# Altium project Shuttler_AMC.PrjPcb (part 20 of 20)
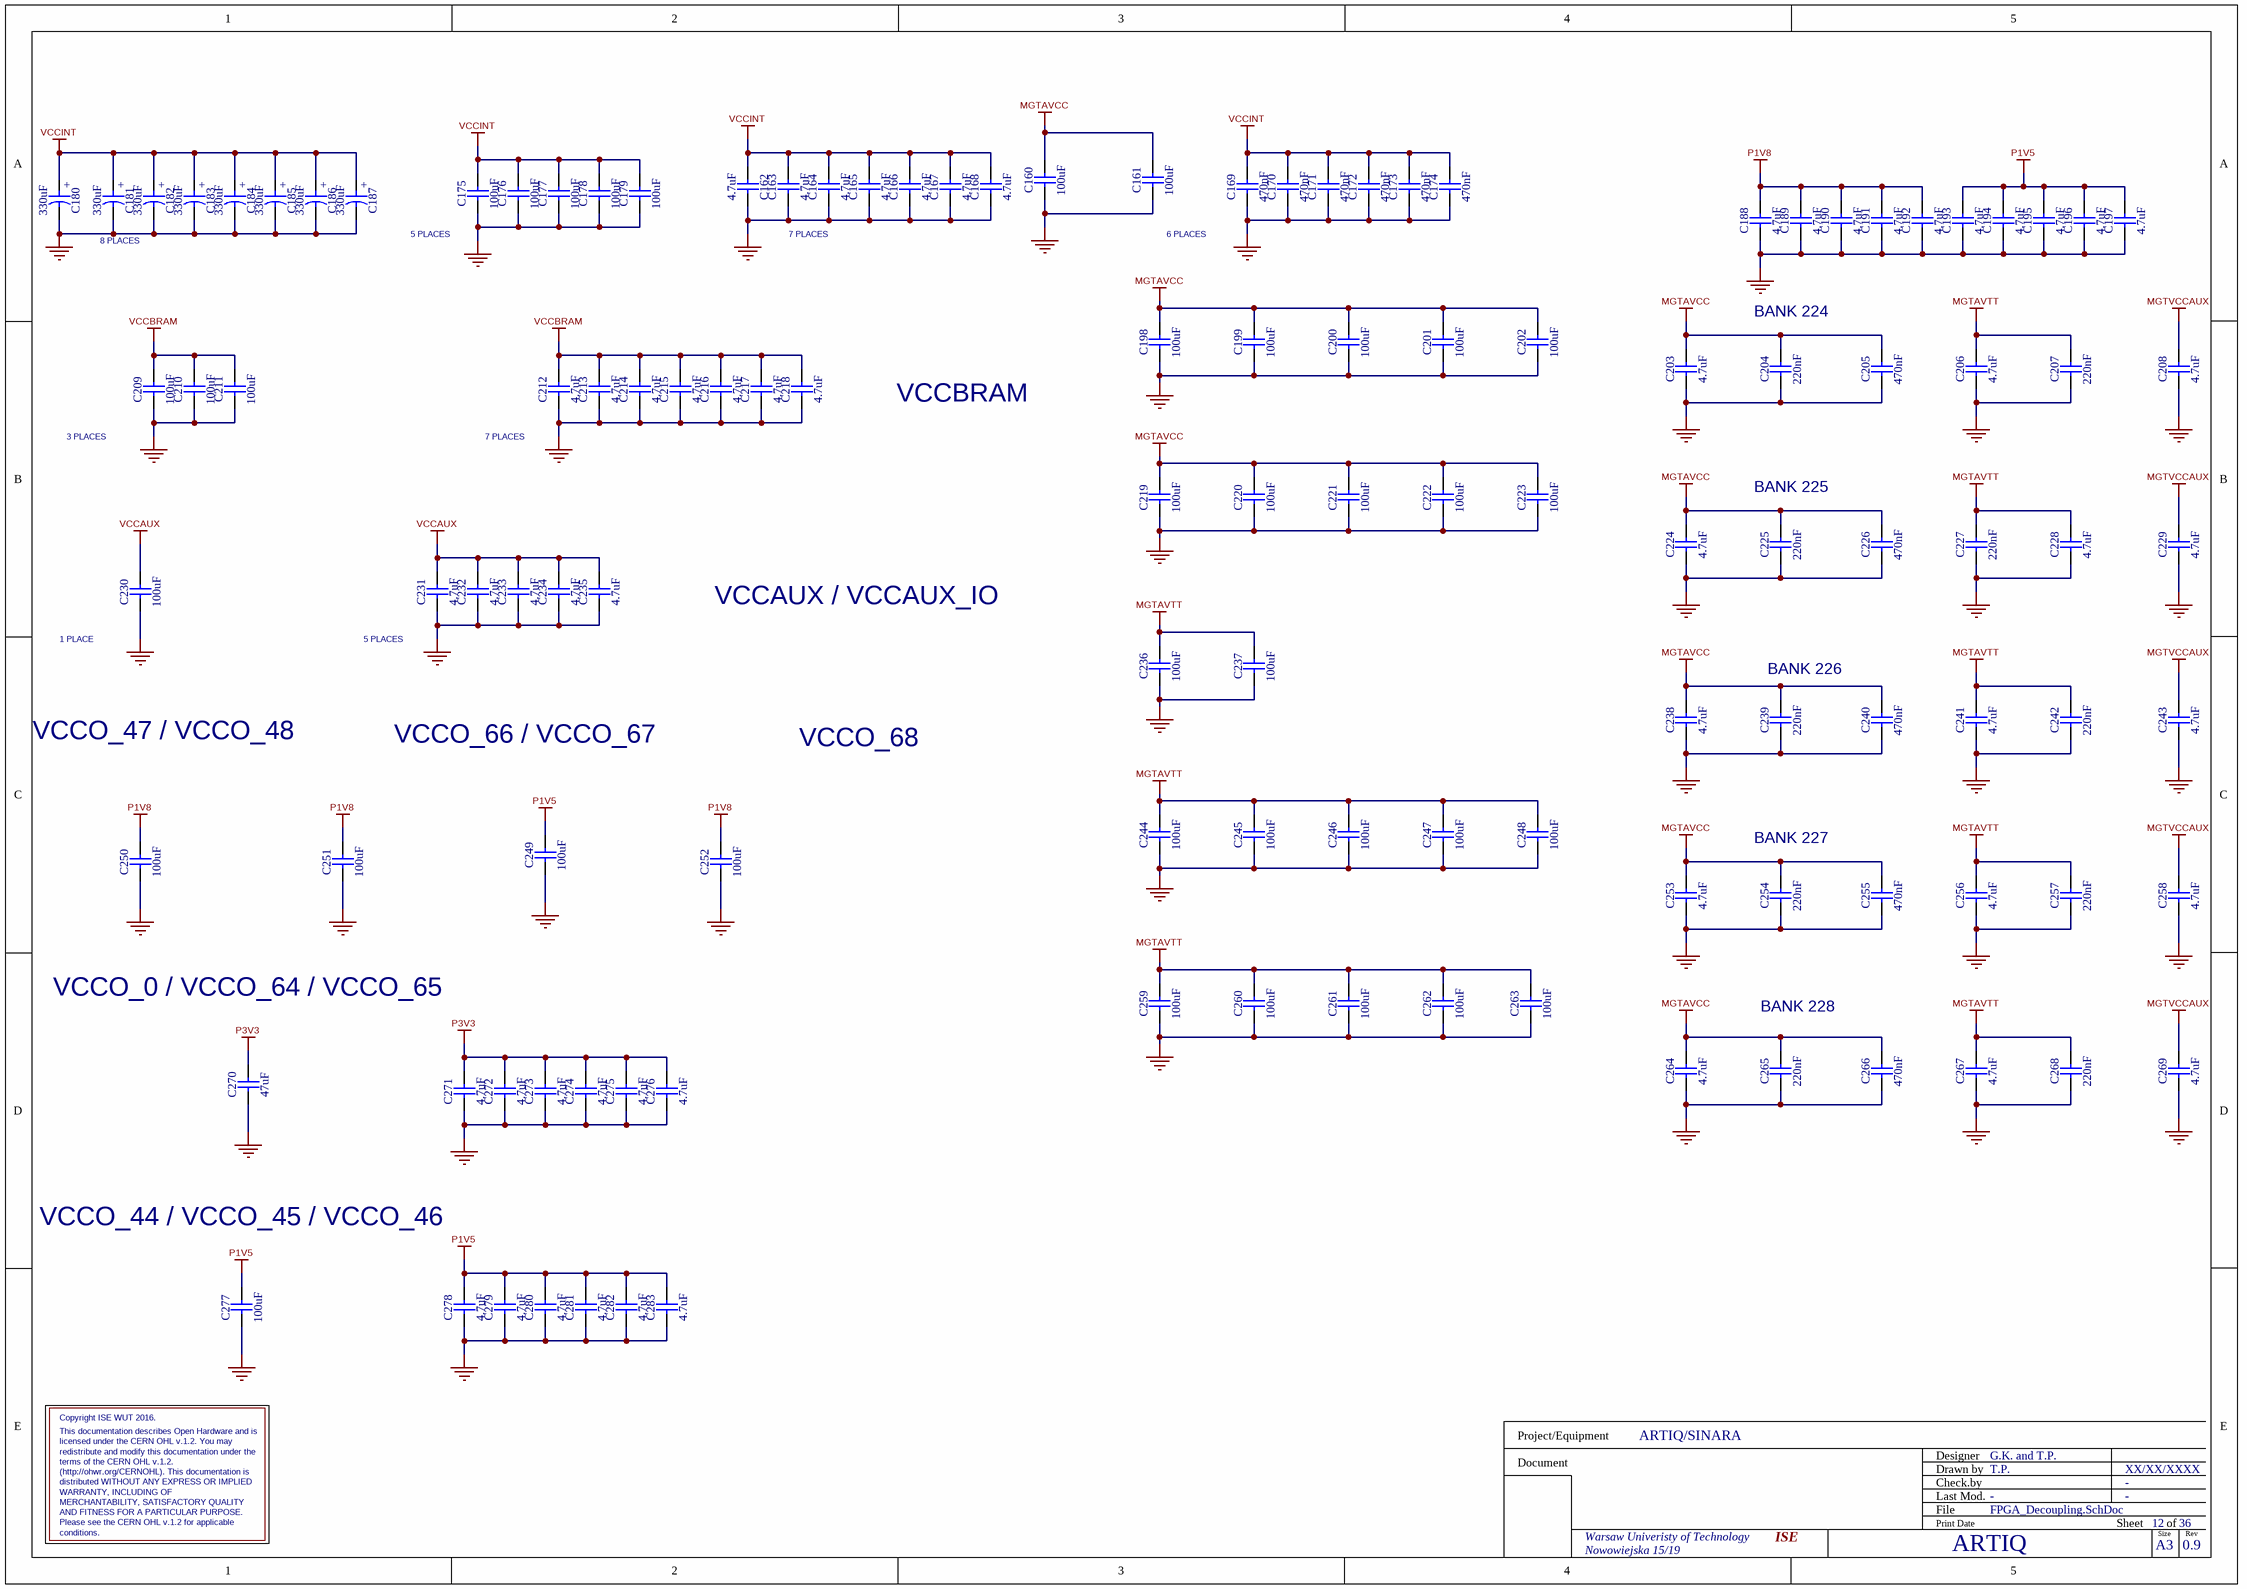
[diagram p38: FPGA_Decoupling.SchDoc]

## Nets that join several sheets (continued)
IOUT_P_U_DAC_LTC2000: DACs/U_DAC_LTC2000 (IC1000_DACs_U_DAC_LTC2000#6.H1), DACs/U_DAC_LTC2000/Amplifier (R1020_DACs_U_DAC_LTC2000_Amplifier#6.1 R1022_DACs_U_DAC_LTC2000_Amplifier#6.2)
IOUT_P_U_DAC_LTC2000: DACs/U_DAC_LTC2000 (IC1000_DACs_U_DAC_LTC2000#7.H1), DACs/U_DAC_LTC2000/Amplifier (R1020_DACs_U_DAC_LTC2000_Amplifier#7.1 R1022_DACs_U_DAC_LTC2000_Amplifier#7.2)
IOUT_P_U_DAC_LTC2000: DACs/U_DAC_LTC2000 (IC1000_DACs_U_DAC_LTC2000#8.H1), DACs/U_DAC_LTC2000/Amplifier (R1020_DACs_U_DAC_LTC2000_Amplifier#8.1 R1022_DACs_U_DAC_LTC2000_Amplifier#8.2)
IOUT_P_U_DAC_LTC2000: DACs/U_DAC_LTC2000 (IC1000_DACs_U_DAC_LTC2000#9.H1), DACs/U_DAC_LTC2000/Amplifier (R1020_DACs_U_DAC_LTC2000_Amplifier#9.1 R1022_DACs_U_DAC_LTC2000_Amplifier#9.2)
IOUT_P_U_DAC_LTC2000: DACs/U_DAC_LTC2000 (IC1000_DACs_U_DAC_LTC2000#10.H1), DACs/U_DAC_LTC2000/Amplifier (R1020_DACs_U_DAC_LTC2000_Amplifier#10.1 R1022_DACs_U_DAC_LTC2000_Amplifier#10.2)
IOUT_P_U_DAC_LTC2000: DACs/U_DAC_LTC2000 (IC1000_DACs_U_DAC_LTC2000#11.H1), DACs/U_DAC_LTC2000/Amplifier (R1020_DACs_U_DAC_LTC2000_Amplifier#11.1 R1022_DACs_U_DAC_LTC2000_Amplifier#11.2)
IOUT_P_U_DAC_LTC2000: DACs/U_DAC_LTC2000 (IC1000_DACs_U_DAC_LTC2000#12.H1), DACs/U_DAC_LTC2000/Amplifier (R1020_DACs_U_DAC_LTC2000_Amplifier#12.1 R1022_DACs_U_DAC_LTC2000_Amplifier#12.2)
IOUT_P_U_DAC_LTC2000: DACs/U_DAC_LTC2000 (IC1000_DACs_U_DAC_LTC2000#13.H1), DACs/U_DAC_LTC2000/Amplifier (R1020_DACs_U_DAC_LTC2000_Amplifier#13.1 R1022_DACs_U_DAC_LTC2000_Amplifier#13.2)
IOUT_P_U_DAC_LTC2000: DACs/U_DAC_LTC2000 (IC1000_DACs_U_DAC_LTC2000#14.H1), DACs/U_DAC_LTC2000/Amplifier (R1020_DACs_U_DAC_LTC2000_Amplifier#14.1 R1022_DACs_U_DAC_LTC2000_Amplifier#14.2)
IOUT_P_U_DAC_LTC2000: DACs/U_DAC_LTC2000 (IC1000_DACs_U_DAC_LTC2000#15.H1), DACs/U_DAC_LTC2000/Amplifier (R1020_DACs_U_DAC_LTC2000_Amplifier#15.1 R1022_DACs_U_DAC_LTC2000_Amplifier#15.2)
IOUT_P_U_DAC_LTC2000: DACs/U_DAC_LTC2000 (IC1000_DACs_U_DAC_LTC2000#16.H1), DACs/U_DAC_LTC2000/Amplifier (R1020_DACs_U_DAC_LTC2000_Amplifier#16.1 R1022_DACs_U_DAC_LTC2000_Amplifier#16.2)
IOUT_P_U_DAC_LTC2000: DACs/U_DAC_LTC2000 (IC1000_DACs_U_DAC_LTC2000#17.H1), DACs/U_DAC_LTC2000/Amplifier (R1020_DACs_U_DAC_LTC2000_Amplifier#17.1 R1022_DACs_U_DAC_LTC2000_Amplifier#17.2)
IOUT_P_U_DAC_LTC2000: DACs/U_DAC_LTC2000 (IC1000_DACs_U_DAC_LTC2000#18.H1), DACs/U_DAC_LTC2000/Amplifier (R1020_DACs_U_DAC_LTC2000_Amplifier#18.1 R1022_DACs_U_DAC_LTC2000_Amplifier#18.2)
IPMB.SCL_L: AMC_Connector (J1.56), CPU_LPC1776 (D2.1 IC11.L3 R43.2)
IPMB.SDA_L: AMC_Connector (J1.71), CPU_LPC1776 (D3.1 IC11.M1 R45.2)
LTM_1V5_OUT: PWR_DC_DC_EXAR2 (C114.2 L70.1 L71.1 MOD1.22), QUAD_BUCK (5 pins)
LTM_1V8_OUT: PWR_DC_DC_EXAR2 (C113.2 L66.1 L68.1 MOD1.18), QUAD_BUCK (5 pins)
LTM_1V_OUT: PWR_DC_DC_EXAR2 (5 pins), QUAD_BUCK (5 pins)
LTM_3V3_OUT: PWR_DC_DC_EXAR2 (C110.2 L49.1 L61.1 MOD1.13), QUAD_BUCK (5 pins)
LTM_PGOOD: QUAD_BUCK (5 pins), CPU_LPC1776 (IC11.A7)
Main_DCXO_N: Clk_recovery (C594.2 C639.2 IC45.2), DDMTD (C730.1)
Main_DCXO_OE: Clk_recovery (R367.1 R383.1), FPGA_Banks_64_65_HR (IC27.P25)
Main_DCXO_P: Clk_recovery (C592.2 IC45.1), DDMTD (C729.1)
Main_DCXO_SCL: Clk_recovery (OSC1.8 R322.1 TP39.1), FPGA_Banks_64_65_HR (IC27.N23)
Main_DCXO_SDA: Clk_recovery (OSC1.7 R325.1 TP38.1), FPGA_Banks_64_65_HR (IC27.N27)
MGT_CDR_CLK_N: DDMTD (C707.1 R483.2), FPGA_Banks_GTH (IC27.AD5)
MGT_CDR_CLK_P: DDMTD (C703.1 R483.1), FPGA_Banks_GTH (IC27.AD6)
MLVDS_AMC_PORTS.Rx17_N: AMC_Connector (J1.141), M-LVDS_PHY (IC34.14)
MLVDS_AMC_PORTS.Rx17_P: AMC_Connector (J1.142), M-LVDS_PHY (IC34.13)
MLVDS_AMC_PORTS.Rx18_N: AMC_Connector (J1.147), M-LVDS_PHY (IC34.4)
MLVDS_AMC_PORTS.Rx18_P: AMC_Connector (J1.148), M-LVDS_PHY (IC34.3)
MLVDS_AMC_PORTS.Rx19_N: AMC_Connector (J1.153), M-LVDS_PHY (IC36.14)
MLVDS_AMC_PORTS.Rx19_P: AMC_Connector (J1.154), M-LVDS_PHY (IC36.13)
MLVDS_AMC_PORTS.Rx20_N: AMC_Connector (J1.159), M-LVDS_PHY (IC36.4)
MLVDS_AMC_PORTS.Rx20_P: AMC_Connector (J1.160), M-LVDS_PHY (IC36.3)
MLVDS_AMC_PORTS.Tx17_N: AMC_Connector (J1.144), M-LVDS_PHY (IC34.10)
MLVDS_AMC_PORTS.Tx17_P: AMC_Connector (J1.145), M-LVDS_PHY (IC34.9)
MLVDS_AMC_PORTS.Tx18_N: AMC_Connector (J1.150), M-LVDS_PHY (IC34.48)
MLVDS_AMC_PORTS.Tx18_P: AMC_Connector (J1.151), M-LVDS_PHY (IC34.47)
MLVDS_AMC_PORTS.Tx19_N: AMC_Connector (J1.156), M-LVDS_PHY (IC36.10)
MLVDS_AMC_PORTS.Tx19_P: AMC_Connector (J1.157), M-LVDS_PHY (IC36.9)
MLVDS_AMC_PORTS.Tx20_N: AMC_Connector (J1.162), M-LVDS_PHY (IC36.48)
MLVDS_AMC_PORTS.Tx20_P: AMC_Connector (J1.163), M-LVDS_PHY (IC36.47)
MLVDS_FSEN: M-LVDS_PHY (8 pins), FPGA_Banks_64_65_HR (IC27.G25)
MMC_CONSOLE.ISP_RSTn: USB_SERIAL_QUAD (T17.3), CPU_LPC1776 (SW1.1)
MMC_CONSOLE.LPC_ISPn: USB_SERIAL_QUAD (IC71.4 R349.1), CPU_LPC1776 (SW1.2)
MMC_CONSOLE.MMC_CONS_PROG_RxD: USB_SERIAL_QUAD (IC71.2), CPU_LPC1776 (IC11.A3)
MMC_CONSOLE.MMC_CONS_PROG_TxD: USB_SERIAL_QUAD (IC71.3), CPU_LPC1776 (IC11.D5)
MMC_I2C.SCL: I2C_MUX (B4.1 IC29.19 R143.1), CPU_LPC1776 (IC11.N11)
MMC_I2C.SDA: I2C_MUX (B3.1 IC29.20 R142.1), CPU_LPC1776 (IC11.M10)
MMC_TCK: JTAG_Configuration (IC30.11), CPU_LPC1776 (R60.1)
MMC_TDI: JTAG_Configuration (IC30.2), CPU_LPC1776 (R61.1)
MMC_TDO: JTAG_Configuration (IC30.5), CPU_LPC1776 (R62.1)
MMC_TMS: JTAG_Configuration (IC30.14), CPU_LPC1776 (R63.1)
MMC_TRSTn: JTAG_Configuration (R159.1), CPU_LPC1776 (R64.1)
MOD_HANDLE: Shuttler_AMC (PB1.1 PB1.2), CPU_LPC1776 (IC11.B14 R41.1)
NetC700_1: DDMTD (C700.1 R403.1 R404.2), FPGA_Banks_47_48_HP (IC27.AC34)
NetC733_1: DDMTD (C733.1 R521.1 R522.2), FPGA_Banks_47_48_HP (IC27.U21)
NetIC11_D12: Clk_recovery (IC53.1), CPU_LPC1776 (IC11.D12)
NetIC27_AH16: DDMTD (R486.2 R509.2), FPGA_Banks_44_45_46_DDR64 (IC27.AH16 R106.2 R108.1)
NetIC27_AH17: DDMTD (R468.1 R478.2), FPGA_Banks_44_45_46_DDR64 (IC27.AH17 R110.2 R111.2)
NetIC27_AH18: DDMTD (R465.2 R466.2), FPGA_Banks_44_45_46_DDR64 (IC27.AH18 R109.2 R111.1)
NetIC27_AJ16: DDMTD (R518.1 R520.2), FPGA_Banks_44_45_46_DDR64 (IC27.AJ16 R107.2 R108.2)
OVERTEMPn: Thermometers (6 pins), CPU_LPC1776 (IC11.F11)
P0V95_PG: PWR_DC_DC_EXAR2 (IC72.9 MOD1.8 R78.1), CPU_LPC1776 (IC11.A12)
P0V95I_PG: PWR_0V9_20A (IC39.3 R210.1), PWR_DC_DC_EXAR2 (R86.2), CPU_LPC1776 (IC11.D14)
P1V2_PG: PWR_DC_DC_EXAR2 (IC13.9 MOD1.7 R77.1), CPU_LPC1776 (IC11.A14)
P12V0_OK: POWER_Management (IC38.1 R190.1), CPU_LPC1776 (IC11.N4)
PGOOD_N3V5: PWR_P3V0_N3V0 (IC78.3 R464.1), CPU_LPC1776 (IC11.A8)
PGOOD_P2V5: PWR_Buck_P2V5_8A (IC74.3 R448.1), CPU_LPC1776 (IC11.L5)
PGOOD_P4V0: PWR_Buck_4V_20A (IC73.3 R435.1), CPU_LPC1776 (IC11.P5)
PGOOD_P6V0: PWR_DC_DC_EXAR2 (IC79.7 R87.2), CPU_LPC1776 (IC11.M6)
PGOOD_VTT_DAC: DAC_supply (IC21.9), CPU_LPC1776 (IC11.K3)
PM_I2C.SCL: PWR_DC_DC_EXAR2 (D33.1 MOD1.11 W11.2), I2C_MUX (IC28.13 IC29.13 R137.2)
PM_I2C.SDA: PWR_DC_DC_EXAR2 (D34.1 MOD1.10 W11.3), I2C_MUX (IC28.12 IC29.12 R136.2)
PORT0.Rx0_N: AMC_Connector (J1.15), ETH_PHY_RMII (C718.1 C726.1 J18.5)
PORT0.Rx0_P: AMC_Connector (J1.14), ETH_PHY_RMII (C593.1 C725.1 J18.6)
PORT0.Tx0_N: AMC_Connector (J1.12), ETH_PHY_RMII (C724.1 C728.1 J18.3)
PORT0.Tx0_P: AMC_Connector (J1.11), ETH_PHY_RMII (C723.1 C727.1 J18.2)
PRI_UART_RxD: USB_SERIAL_QUAD (IC64.4), FPGA_Banks_64_65_HR (IC27.K26)
PRI_UART_TxD: USB_SERIAL_QUAD (IC64.5), FPGA_Banks_64_65_HR (IC27.J25)
QSFP0.RX0_N: QSFP (J8_QSFP#1.18), FPGA_Banks_GTH (IC27.P1)
QSFP0.RX0_P: QSFP (J8_QSFP#1.17), FPGA_Banks_GTH (IC27.P2)
QSFP0.RX1_N: QSFP (J8_QSFP#1.22), FPGA_Banks_GTH (IC27.T1)
QSFP0.RX1_P: QSFP (J8_QSFP#1.21), FPGA_Banks_GTH (IC27.T2)
QSFP0.RX2_N: QSFP (J8_QSFP#1.15), FPGA_Banks_GTH (IC27.V1)
QSFP0.RX2_P: QSFP (J8_QSFP#1.14), FPGA_Banks_GTH (IC27.V2)
QSFP0.RX3_N: QSFP (J8_QSFP#1.25), FPGA_Banks_GTH (IC27.Y1)
QSFP0.RX3_P: QSFP (J8_QSFP#1.24), FPGA_Banks_GTH (IC27.Y2)
QSFP0.TX0_N: QSFP (J8_QSFP#1.37), FPGA_Banks_GTH (IC27.R3)
QSFP0.TX0_P: QSFP (J8_QSFP#1.36), FPGA_Banks_GTH (IC27.R4)
QSFP0.TX1_N: QSFP (J8_QSFP#1.3), FPGA_Banks_GTH (IC27.U3)
QSFP0.TX1_P: QSFP (J8_QSFP#1.2), FPGA_Banks_GTH (IC27.U4)
QSFP0.TX2_N: QSFP (J8_QSFP#1.34), FPGA_Banks_GTH (IC27.W3)
QSFP0.TX2_P: QSFP (J8_QSFP#1.33), FPGA_Banks_GTH (IC27.W4)
QSFP0.TX3_N: QSFP (J8_QSFP#1.6), FPGA_Banks_GTH (IC27.AA3)
QSFP0.TX3_P: QSFP (J8_QSFP#1.5), FPGA_Banks_GTH (IC27.AA4)
QSFP0_I2C.SCL: I2C_MUX (IC28.2 IC29.2 R123.2), QSFP (IC44_QSFP#1.14 J8_QSFP#1.11 TP21_QSFP#1.1)
QSFP0_I2C.SDA: I2C_MUX (IC28.1 IC29.1 R122.2), QSFP (IC44_QSFP#1.15 J8_QSFP#1.12 TP22_QSFP#1.1)
QSFP1.RX0_N: QSFP (J8_QSFP#2.18), FPGA_Banks_GTH (IC27.A3)
QSFP1.RX0_P: QSFP (J8_QSFP#2.17), FPGA_Banks_GTH (IC27.A4)
QSFP1.RX1_N: QSFP (J8_QSFP#2.22), FPGA_Banks_GTH (IC27.B1)
QSFP1.RX1_P: QSFP (J8_QSFP#2.21), FPGA_Banks_GTH (IC27.B2)
QSFP1.RX2_N: QSFP (J8_QSFP#2.15), FPGA_Banks_GTH (IC27.D1)
QSFP1.RX2_P: QSFP (J8_QSFP#2.14), FPGA_Banks_GTH (IC27.D2)
QSFP1.RX3_N: QSFP (J8_QSFP#2.25), FPGA_Banks_GTH (IC27.E3)
QSFP1.RX3_P: QSFP (J8_QSFP#2.24), FPGA_Banks_GTH (IC27.E4)
QSFP1.TX0_N: QSFP (J8_QSFP#2.37), FPGA_Banks_GTH (IC27.B5)
QSFP1.TX0_P: QSFP (J8_QSFP#2.36), FPGA_Banks_GTH (IC27.B6)
QSFP1.TX1_N: QSFP (J8_QSFP#2.3), FPGA_Banks_GTH (IC27.C3)
QSFP1.TX1_P: QSFP (J8_QSFP#2.2), FPGA_Banks_GTH (IC27.C4)
QSFP1.TX2_N: QSFP (J8_QSFP#2.34), FPGA_Banks_GTH (IC27.D5)
QSFP1.TX2_P: QSFP (J8_QSFP#2.33), FPGA_Banks_GTH (IC27.D6)
QSFP1.TX3_N: QSFP (J8_QSFP#2.6), FPGA_Banks_GTH (IC27.F5)
QSFP1.TX3_P: QSFP (J8_QSFP#2.5), FPGA_Banks_GTH (IC27.F6)
QSFP1_I2C.SCL: I2C_MUX (IC28.4 IC29.4 R126.2), QSFP (IC44_QSFP#2.14 J8_QSFP#2.11 TP21_QSFP#2.1)
QSFP1_I2C.SDA: I2C_MUX (IC28.3 IC29.3 R124.2), QSFP (IC44_QSFP#2.15 J8_QSFP#2.12 TP22_QSFP#2.1)
QSPI1_CS_B: FPGA_Bank_0_CFG (IC69.7 R375.1), FPGA_Banks_64_65_HR (IC27.G26)
QSPI1_IO0: FPGA_Bank_0_CFG (IC69.15), FPGA_Banks_64_65_HR (IC27.M20)
QSPI1_IO1: FPGA_Bank_0_CFG (IC69.8), FPGA_Banks_64_65_HR (IC27.L20)
QSPI1_IO2: FPGA_Bank_0_CFG (IC69.9 R376.1), FPGA_Banks_64_65_HR (IC27.R21)
QSPI1_IO3: FPGA_Bank_0_CFG (IC69.1 R374.1), FPGA_Banks_64_65_HR (IC27.R22)
RE_DE_RX_P17: M-LVDS_PHY (IC51.3), FPGA_Banks_44_45_46_DDR64 (IC27.AP18)
RE_DE_RX_P18: M-LVDS_PHY (IC51.5), FPGA_Banks_44_45_46_DDR64 (IC27.AJ19)
RE_DE_RX_P19: M-LVDS_PHY (IC51.7), FPGA_Banks_44_45_46_DDR64 (IC27.AN14)
RE_DE_RX_P20: M-LVDS_PHY (IC51.9), FPGA_Banks_44_45_46_DDR64 (IC27.AP14)
RE_DE_TX_P17: M-LVDS_PHY (IC35.3), FPGA_Banks_44_45_46_DDR64 (IC27.AN17)
RE_DE_TX_P18: M-LVDS_PHY (IC35.5), FPGA_Banks_44_45_46_DDR64 (IC27.AM17)
RE_DE_TX_P19: M-LVDS_PHY (IC35.7), FPGA_Banks_44_45_46_DDR64 (IC27.AN16)
RE_DE_TX_P20: M-LVDS_PHY (IC35.9), FPGA_Banks_44_45_46_DDR64 (IC27.AN19)
REC_CLOCK: Clk_recovery (R289.1), FPGA_Banks_64_65_HR (IC27.H27)
REC_CLOCK_N: Clk_recovery (C485.1 IC52.17), DDMTD (C701.1)
REC_CLOCK_P: Clk_recovery (C158.1 IC52.16), DDMTD (C702.1)
REF_CLK_SEL: Clock_Distribution_PLL (IC7.32), FPGA_Banks_64_65_HR (IC27.G27)
RF_OUT: Shuttler_AMC (C686.2 J31.1 J31.2 R313.1), Clk_recovery (C488.2)
RGMII2_RXD0: ETH_PHY_RMII (R357.2), FPGA_Banks_64_65_HR (IC27.R23)
RGMII2_RXD1: ETH_PHY_RMII (R358.2), FPGA_Banks_64_65_HR (IC27.P23)
RGMII2_RXD2: ETH_PHY_RMII (R359.2), FPGA_Banks_64_65_HR (IC27.R25)
RGMII2_RXD3: ETH_PHY_RMII (R360.2), FPGA_Banks_64_65_HR (IC27.R26)
RGMII2_TXD0: ETH_PHY_RMII (IC66.50), FPGA_Banks_64_65_HR (IC27.K20)
RGMII2_TXD1: ETH_PHY_RMII (IC66.51), FPGA_Banks_64_65_HR (IC27.K22)
RGMII2_TXD2: ETH_PHY_RMII (IC66.54), FPGA_Banks_64_65_HR (IC27.P20)
RGMII2_TXD3: ETH_PHY_RMII (IC66.55), FPGA_Banks_64_65_HR (IC27.P21)
SDRAM_DDR3_x64.DDR3_64_CAS_N: SDRAM_DDR3_4x16 (5 pins), FPGA_Banks_44_45_46_DDR64 (IC27.AK18)
SDRAM_DDR3_x64.DDR3_64_CK_N: SDRAM_DDR3_4x16 (5 pins), FPGA_Banks_44_45_46_DDR64 (IC27.AE15)
SDRAM_DDR3_x64.DDR3_64_CK_P: SDRAM_DDR3_4x16 (5 pins), FPGA_Banks_44_45_46_DDR64 (IC27.AE16)
SDRAM_DDR3_x64.DDR3_64_CKE: SDRAM_DDR3_4x16 (5 pins), FPGA_Banks_44_45_46_DDR64 (IC27.AL19)
SDRAM_DDR3_x64.DDR3_64_CS_N: SDRAM_DDR3_4x16 (5 pins), FPGA_Banks_44_45_46_DDR64 (IC27.AF18)
SDRAM_DDR3_x64.DDR3_64_DQS0_N: SDRAM_DDR3_4x16 (IC46.G3), FPGA_Banks_44_45_46_DDR64 (IC27.AH21)
SDRAM_DDR3_x64.DDR3_64_DQS0_P: SDRAM_DDR3_4x16 (IC46.F3), FPGA_Banks_44_45_46_DDR64 (IC27.AG21)
SDRAM_DDR3_x64.DDR3_64_DQS1_N: SDRAM_DDR3_4x16 (IC46.B7), FPGA_Banks_44_45_46_DDR64 (IC27.AJ25)
SDRAM_DDR3_x64.DDR3_64_DQS1_P: SDRAM_DDR3_4x16 (IC46.C7), FPGA_Banks_44_45_46_DDR64 (IC27.AH24)
SDRAM_DDR3_x64.DDR3_64_DQS2_N: SDRAM_DDR3_4x16 (IC47.G3), FPGA_Banks_44_45_46_DDR64 (IC27.AK20)
SDRAM_DDR3_x64.DDR3_64_DQS2_P: SDRAM_DDR3_4x16 (IC47.F3), FPGA_Banks_44_45_46_DDR64 (IC27.AJ20)
SDRAM_DDR3_x64.DDR3_64_DQS3_N: SDRAM_DDR3_4x16 (IC47.B7), FPGA_Banks_44_45_46_DDR64 (IC27.AP21)
SDRAM_DDR3_x64.DDR3_64_DQS3_P: SDRAM_DDR3_4x16 (IC47.C7), FPGA_Banks_44_45_46_DDR64 (IC27.AP20)
SDRAM_DDR3_x64.DDR3_64_DQS4_N: SDRAM_DDR3_4x16 (IC48.G3), FPGA_Banks_44_45_46_DDR64 (IC27.AL28)
SDRAM_DDR3_x64.DDR3_64_DQS4_P: SDRAM_DDR3_4x16 (IC48.F3), FPGA_Banks_44_45_46_DDR64 (IC27.AL27)
SDRAM_DDR3_x64.DDR3_64_DQS5_N: SDRAM_DDR3_4x16 (IC48.B7), FPGA_Banks_44_45_46_DDR64 (IC27.AP30)
SDRAM_DDR3_x64.DDR3_64_DQS5_P: SDRAM_DDR3_4x16 (IC48.C7), FPGA_Banks_44_45_46_DDR64 (IC27.AN29)
SDRAM_DDR3_x64.DDR3_64_DQS6_N: SDRAM_DDR3_4x16 (IC49.G3), FPGA_Banks_44_45_46_DDR64 (IC27.AJ33)
SDRAM_DDR3_x64.DDR3_64_DQS6_P: SDRAM_DDR3_4x16 (IC49.F3), FPGA_Banks_44_45_46_DDR64 (IC27.AH33)
SDRAM_DDR3_x64.DDR3_64_DQS7_N: SDRAM_DDR3_4x16 (IC49.B7), FPGA_Banks_44_45_46_DDR64 (IC27.AP34)
SDRAM_DDR3_x64.DDR3_64_DQS7_P: SDRAM_DDR3_4x16 (IC49.C7), FPGA_Banks_44_45_46_DDR64 (IC27.AN34)
SDRAM_DDR3_x64.DDR3_64_ODT: SDRAM_DDR3_4x16 (5 pins), FPGA_Banks_44_45_46_DDR64 (IC27.AJ18)
SDRAM_DDR3_x64.DDR3_64_RAS_N: SDRAM_DDR3_4x16 (5 pins), FPGA_Banks_44_45_46_DDR64 (IC27.AH19)
SDRAM_DDR3_x64.DDR3_64_RST_N: SDRAM_DDR3_4x16 (5 pins), FPGA_Banks_44_45_46_DDR64 (IC27.AJ14)
SDRAM_DDR3_x64.DDR3_64_WE_N: SDRAM_DDR3_4x16 (5 pins), FPGA_Banks_44_45_46_DDR64 (IC27.AG19)
SDRAM_PGOOD: SDRAM_DDR3_4x16 (IC50.9), CPU_LPC1776 (IC11.E14)
SENS_I2C.SCL: I2C_MUX (IC28.15 IC29.15 R139.2), Thermometers (6 pins)
SENS_I2C.SDA: I2C_MUX (IC28.14 IC29.14 R138.2), Thermometers (6 pins)
SI5324_I2C.SCL: Clk_recovery (IC52.22 TP35.1), I2C_MUX (IC28.11 IC29.11 R135.2)
SI5324_I2C.SDA: Clk_recovery (IC52.23 TP34.1), I2C_MUX (IC28.10 IC29.10 R134.2)
SI5324_RST: Clk_recovery (IC52.1), FPGA_Banks_64_65_HR (IC27.AH13)
SPI_0_3.MISO: DACs (IC22.5), DACs/U_DAC_LTC2000 (IC1000_DACs_U_DAC_LTC2000#13.S3), DACs/U_DAC_LTC2000 (IC1000_DACs_U_DAC_LTC2000#14.S3), DACs/U_DAC_LTC2000 (IC1000_DACs_U_DAC_LTC2000#15.S3), DACs/U_DAC_LTC2000 (IC1000_DACs_U_DAC_LTC2000#16.S3)
SPI_0_3.MOSI: DACs (IC22.6), DACs/U_DAC_LTC2000 (IC1000_DACs_U_DAC_LTC2000#13.S4), DACs/U_DAC_LTC2000 (IC1000_DACs_U_DAC_LTC2000#14.S4), DACs/U_DAC_LTC2000 (IC1000_DACs_U_DAC_LTC2000#15.S4), DACs/U_DAC_LTC2000 (IC1000_DACs_U_DAC_LTC2000#16.S4)
SPI_0_3.SCK: DACs (IC22.11), DACs/U_DAC_LTC2000 (IC1000_DACs_U_DAC_LTC2000#13.S5), DACs/U_DAC_LTC2000 (IC1000_DACs_U_DAC_LTC2000#14.S5), DACs/U_DAC_LTC2000 (IC1000_DACs_U_DAC_LTC2000#15.S5), DACs/U_DAC_LTC2000 (IC1000_DACs_U_DAC_LTC2000#16.S5)
SPI_4_7.MISO: DACs (IC23.5), DACs/U_DAC_LTC2000 (IC1000_DACs_U_DAC_LTC2000#7.S3), DACs/U_DAC_LTC2000 (IC1000_DACs_U_DAC_LTC2000#8.S3), DACs/U_DAC_LTC2000 (IC1000_DACs_U_DAC_LTC2000#17.S3), DACs/U_DAC_LTC2000 (IC1000_DACs_U_DAC_LTC2000#18.S3)
SPI_4_7.MOSI: DACs (IC23.6), DACs/U_DAC_LTC2000 (IC1000_DACs_U_DAC_LTC2000#7.S4), DACs/U_DAC_LTC2000 (IC1000_DACs_U_DAC_LTC2000#8.S4), DACs/U_DAC_LTC2000 (IC1000_DACs_U_DAC_LTC2000#17.S4), DACs/U_DAC_LTC2000 (IC1000_DACs_U_DAC_LTC2000#18.S4)
SPI_4_7.SCK: DACs (IC23.11), DACs/U_DAC_LTC2000 (IC1000_DACs_U_DAC_LTC2000#7.S5), DACs/U_DAC_LTC2000 (IC1000_DACs_U_DAC_LTC2000#8.S5), DACs/U_DAC_LTC2000 (IC1000_DACs_U_DAC_LTC2000#17.S5), DACs/U_DAC_LTC2000 (IC1000_DACs_U_DAC_LTC2000#18.S5)
SPI_8_11.MISO: DACs (IC24.5), DACs/U_DAC_LTC2000 (IC1000_DACs_U_DAC_LTC2000#9.S3), DACs/U_DAC_LTC2000 (IC1000_DACs_U_DAC_LTC2000#10.S3), DACs/U_DAC_LTC2000 (IC1000_DACs_U_DAC_LTC2000#11.S3), DACs/U_DAC_LTC2000 (IC1000_DACs_U_DAC_LTC2000#12.S3)
SPI_8_11.MOSI: DACs (IC24.6), DACs/U_DAC_LTC2000 (IC1000_DACs_U_DAC_LTC2000#9.S4), DACs/U_DAC_LTC2000 (IC1000_DACs_U_DAC_LTC2000#10.S4), DACs/U_DAC_LTC2000 (IC1000_DACs_U_DAC_LTC2000#11.S4), DACs/U_DAC_LTC2000 (IC1000_DACs_U_DAC_LTC2000#12.S4)
SPI_8_11.SCK: DACs (IC24.11), DACs/U_DAC_LTC2000 (IC1000_DACs_U_DAC_LTC2000#9.S5), DACs/U_DAC_LTC2000 (IC1000_DACs_U_DAC_LTC2000#10.S5), DACs/U_DAC_LTC2000 (IC1000_DACs_U_DAC_LTC2000#11.S5), DACs/U_DAC_LTC2000 (IC1000_DACs_U_DAC_LTC2000#12.S5)
SPI_12_15.MISO: DACs (IC25.5), DACs/U_DAC_LTC2000 (IC1000_DACs_U_DAC_LTC2000#1.S3), DACs/U_DAC_LTC2000 (IC1000_DACs_U_DAC_LTC2000#2.S3), DACs/U_DAC_LTC2000 (IC1000_DACs_U_DAC_LTC2000#3.S3), DACs/U_DAC_LTC2000 (IC1000_DACs_U_DAC_LTC2000#4.S3)
SPI_12_15.MOSI: DACs (IC25.6), DACs/U_DAC_LTC2000 (IC1000_DACs_U_DAC_LTC2000#1.S4), DACs/U_DAC_LTC2000 (IC1000_DACs_U_DAC_LTC2000#2.S4), DACs/U_DAC_LTC2000 (IC1000_DACs_U_DAC_LTC2000#3.S4), DACs/U_DAC_LTC2000 (IC1000_DACs_U_DAC_LTC2000#4.S4)
SPI_12_15.SCK: DACs (IC25.11), DACs/U_DAC_LTC2000 (IC1000_DACs_U_DAC_LTC2000#1.S5), DACs/U_DAC_LTC2000 (IC1000_DACs_U_DAC_LTC2000#2.S5), DACs/U_DAC_LTC2000 (IC1000_DACs_U_DAC_LTC2000#3.S5), DACs/U_DAC_LTC2000 (IC1000_DACs_U_DAC_LTC2000#4.S5)
SPI_16_17.MISO: DACs (IC26.5), DACs/U_DAC_LTC2000 (IC1000_DACs_U_DAC_LTC2000#5.S3), DACs/U_DAC_LTC2000 (IC1000_DACs_U_DAC_LTC2000#6.S3)
SPI_16_17.MOSI: DACs (IC26.6), DACs/U_DAC_LTC2000 (IC1000_DACs_U_DAC_LTC2000#5.S4), DACs/U_DAC_LTC2000 (IC1000_DACs_U_DAC_LTC2000#6.S4)
SPI_16_17.SCK: DACs (IC26.11), DACs/U_DAC_LTC2000 (IC1000_DACs_U_DAC_LTC2000#5.S5), DACs/U_DAC_LTC2000 (IC1000_DACs_U_DAC_LTC2000#6.S5)
SSP0.MISO: Shuttler_AMC (IC54.8), CPU_LPC1776 (IC11.J12)
SSP0.MOSI: Shuttler_AMC (IC54.15), CPU_LPC1776 (IC11.J13)
SSP0.SCK: Shuttler_AMC (IC54.16), CPU_LPC1776 (IC11.H13)
SSP0.SSEL: Shuttler_AMC (IC54.7), CPU_LPC1776 (IC11.H14)
SW: Shuttler_AMC (PB2.1), CPU_LPC1776 (IC11.F10 R40.1)
TCLKA_N: AMC_Connector (J1.75), Clk_recovery (C494.1)
TCLKA_P: AMC_Connector (J1.74), Clk_recovery (C486.1)
TCLKB_N: AMC_Connector (J1.78), Clk_recovery (C517.1)
TCLKB_P: AMC_Connector (J1.77), Clk_recovery (C518.1)
USB_JTAG.TCK_PROG: USB_SERIAL_QUAD (IC62.12), JTAG_Configuration (IC31.9 R162.1)
USB_JTAG.TDI_PROG: USB_SERIAL_QUAD (IC62.13), JTAG_Configuration (IC31.8 R163.1)
USB_JTAG.TDO_PROG: USB_SERIAL_QUAD (IC62.14), JTAG_Configuration (IC32.9 R164.1)
USB_JTAG.TMS_PROG: USB_SERIAL_QUAD (IC62.15), JTAG_Configuration (IC32.8 R165.1)
USB_JTAG.USB_ACTIVE: USB_SERIAL_QUAD (R330.1), JTAG_Configuration (T4.1)

## Assembly variants
Default: not fitted C110 C112 C113 C114 C486 C494 C590 C593 C594 C700 C701 C713 C714 C718 C723 C724 C733 IC54 IC72 L48 MOD1 OSC3 R54 R66 R67 R69 R108 R111 R114 R119 R172 R208 R354 R372 R377 R383 R392 R399 R400 R401 R402 R422 R465 R466 R468 R471 R478 R481 R486 R488 R491 R509 R518 R520 W2; alternate parts C589 -> CC0402_1UF_16V_10%_X5R